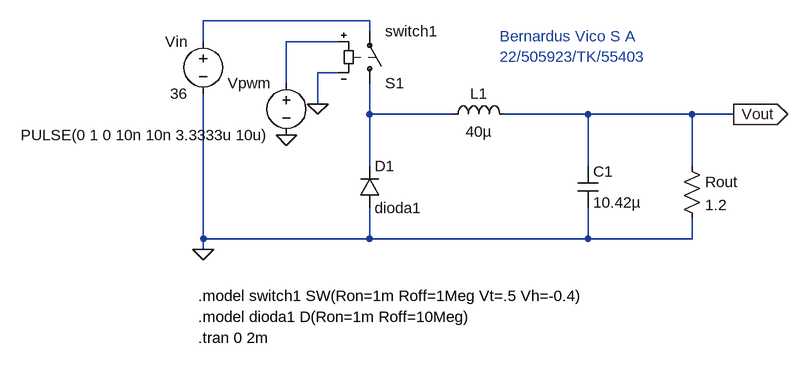
[diagram p0: schematic Tugas9_BuckConverter.asc]
Tugas9_BuckConverter.asc, the LTspice schematic file:
Version 4.1
SHEET 1 880 680
WIRE 192 48 -64 48
WIRE 192 64 192 48
WIRE -64 80 -64 48
WIRE 144 80 64 80
WIRE 144 128 112 128
WIRE 64 144 64 80
WIRE 112 176 112 128
WIRE 192 192 192 144
WIRE 320 192 192 192
WIRE 528 192 400 192
WIRE 688 192 528 192
WIRE 752 192 688 192
WIRE 192 272 192 192
WIRE 528 272 528 192
WIRE 688 272 688 192
WIRE -64 384 -64 160
WIRE 192 384 192 336
WIRE 192 384 -64 384
WIRE 528 384 528 336
WIRE 528 384 192 384
WIRE 688 384 688 352
WIRE 688 384 528 384
WIRE -64 400 -64 384
FLAG 112 176 0
FLAG 64 224 0
FLAG 752 192 Vout
IOPIN 752 192 Out
FLAG -64 400 0
SYMBOL voltage -64 64 M0
SYMATTR InstName Vin
SYMATTR Value 36
SYMBOL voltage 64 128 M0
WINDOW 123 0 0 Left 0
WINDOW 39 0 0 Left 0
SYMATTR InstName Vpwm
SYMATTR Value PULSE(0 1 0 10n 10n 3.3333u 10u)
SYMBOL sw 192 160 M180
SYMATTR InstName S1
SYMATTR Value switch1
SYMBOL diode 176 336 M180
WINDOW 0 24 64 Left 2
WINDOW 3 24 0 Left 2
SYMATTR InstName D1
SYMATTR Value dioda1
SYMBOL ind 304 208 R270
WINDOW 0 32 56 VTop 2
WINDOW 3 5 56 VBottom 2
SYMATTR InstName L1
SYMATTR Value 40µ
SYMBOL cap 512 272 R0
SYMATTR InstName C1
SYMATTR Value 10.42µ
SYMBOL res 672 256 R0
SYMATTR InstName Rout
SYMATTR Value 1.2
TEXT -72 472 Left 2 !.model switch1 SW(Ron=1m Roff=1Meg Vt=.5 Vh=-0.4)
TEXT -72 504 Left 2 !.model dioda1 D(Ron=1m Roff=10Meg)
TEXT -72 536 Left 2 !.tran 0 2m
TEXT 392 72 Left 2 ;Bernardus Vico S A\n22/505923/TK/55403

The netlist it stands for:
* Tugas9_BuckConverter.asc
Vin N001 0 36
Vpwm N002 0 PULSE(0 1 0 10n 10n 3.3333u 10u)
S1 N003 N001 N002 0 switch1
D1 0 N003 dioda1
L1 N003 Vout 40µ
C1 Vout 0 10.42µ
Rout Vout 0 1.2
.model D D
.lib standard.dio
.model switch1 SW(Ron=1m Roff=1Meg Vt=.5 Vh=-0.4)
.model dioda1 D(Ron=1m Roff=10Meg)
.tran 0 2m
* Bernardus Vico S A
* 22/505923/TK/55403
.backanno
.end